# Altium schematic sheet SHIELD_ENC28J60.SchDoc
size A3
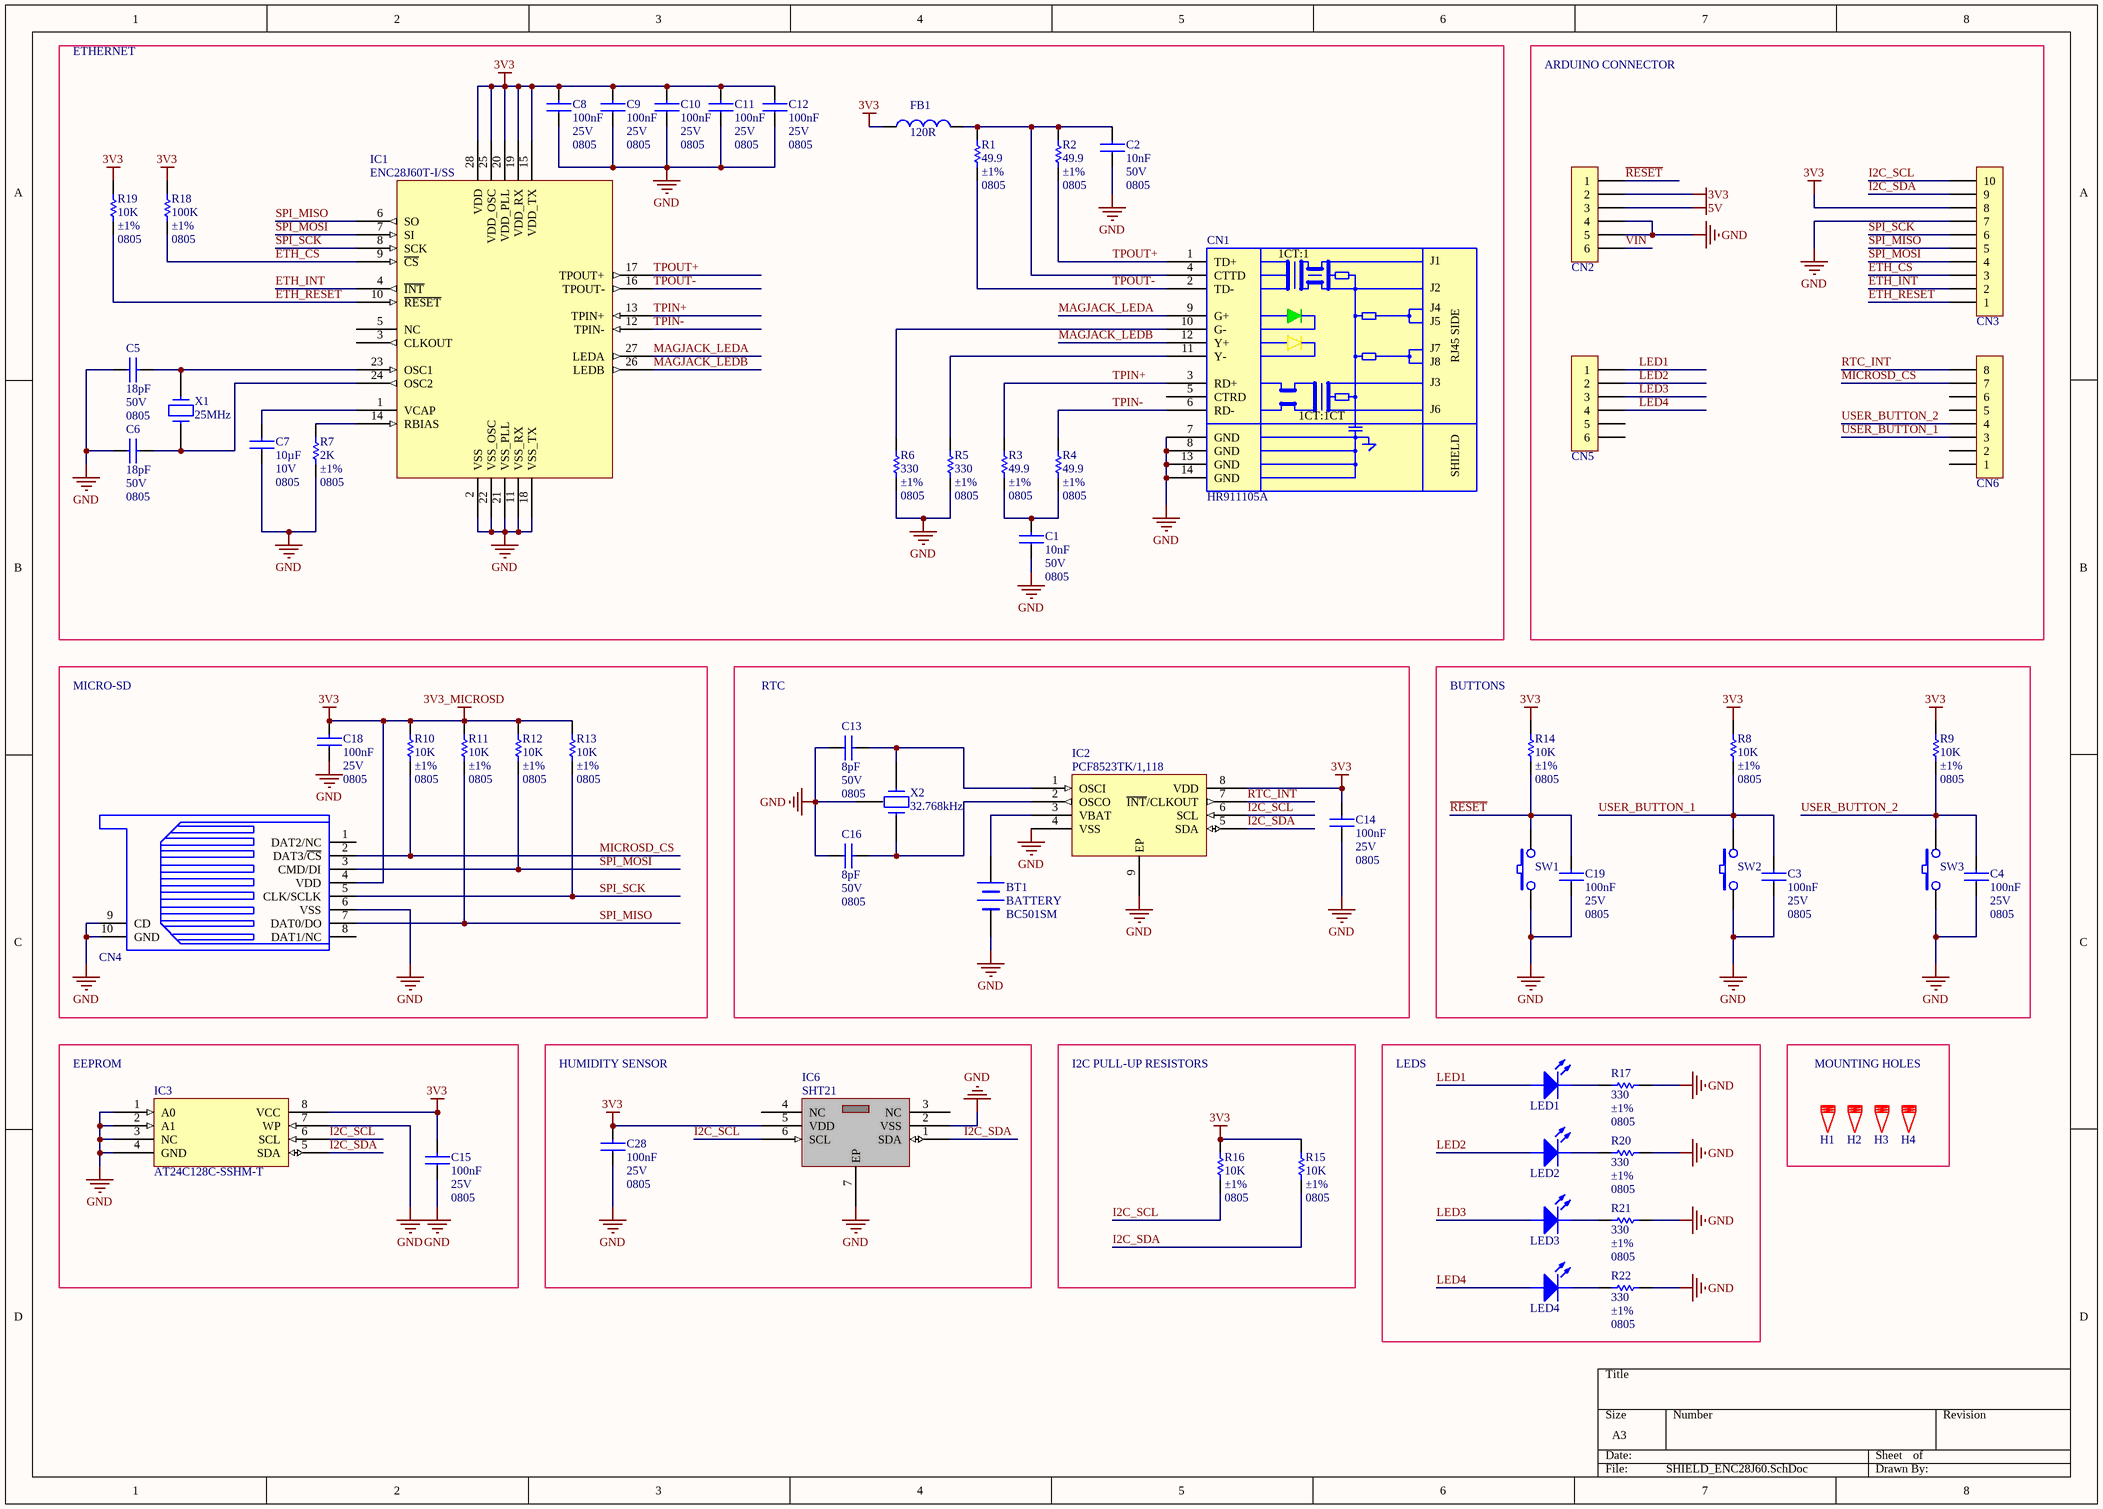
[diagram p0: SHIELD_ENC28J60.SchDoc]

## Parts
BT1  BATTERY  Manufacturer Part Number: BC501SM  [MPD_BC501SM]
C1  Capacitance: 10nF  Voltage - Rated: 50V  Package / Case: 0805  [CAPC2012X100N_EIA0805]  (hidden comment: CAP_NP)
C2  Capacitance: 10nF  Voltage - Rated: 50V  Package / Case: 0805  [CAPC2012X100N_EIA0805]  (hidden comment: CAP_NP)
C3  Capacitance: 100nF  Voltage - Rated: 25V  Package / Case: 0805  [CAPC2012X100N_EIA0805]  (hidden comment: CAP_NP)
C4  Capacitance: 100nF  Voltage - Rated: 25V  Package / Case: 0805  [CAPC2012X100N_EIA0805]  (hidden comment: CAP_NP)
C5  Capacitance: 18pF  Voltage - Rated: 50V  Package / Case: 0805  [CAPC2012X100N_EIA0805]  (hidden comment: CAP_NP)
C6  Capacitance: 18pF  Voltage - Rated: 50V  Package / Case: 0805  [CAPC2012X100N_EIA0805]  (hidden comment: CAP_NP)
C7  Capacitance: 10µF  Voltage - Rated: 10V  Package / Case: 0805  [CAPC2012X100N_EIA0805]  (hidden comment: CAP_NP)
C8  Capacitance: 100nF  Voltage - Rated: 25V  Package / Case: 0805  [CAPC2012X100N_EIA0805]  (hidden comment: CAP_NP)
C9  Capacitance: 100nF  Voltage - Rated: 25V  Package / Case: 0805  [CAPC2012X100N_EIA0805]  (hidden comment: CAP_NP)
C10  Capacitance: 100nF  Voltage - Rated: 25V  Package / Case: 0805  [CAPC2012X100N_EIA0805]  (hidden comment: CAP_NP)
C11  Capacitance: 100nF  Voltage - Rated: 25V  Package / Case: 0805  [CAPC2012X100N_EIA0805]  (hidden comment: CAP_NP)
C12  Capacitance: 100nF  Voltage - Rated: 25V  Package / Case: 0805  [CAPC2012X100N_EIA0805]  (hidden comment: CAP_NP)
C13  Capacitance: 8pF  Voltage - Rated: 50V  Package / Case: 0805  [CAPC2012X100N_EIA0805]  (hidden comment: CAP_NP)
C14  Capacitance: 100nF  Voltage - Rated: 25V  Package / Case: 0805  [CAPC2012X100N_EIA0805]  (hidden comment: CAP_NP)
C15  Capacitance: 100nF  Voltage - Rated: 25V  Package / Case: 0805  [CAPC2012X100N_EIA0805]  (hidden comment: CAP_NP)
C16  Capacitance: 8pF  Voltage - Rated: 50V  Package / Case: 0805  [CAPC2012X100N_EIA0805]  (hidden comment: CAP_NP)
C18  Capacitance: 100nF  Voltage - Rated: 25V  Package / Case: 0805  [CAPC2012X100N_EIA0805]  (hidden comment: CAP_NP)
C19  Capacitance: 100nF  Voltage - Rated: 25V  Package / Case: 0805  [CAPC2012X100N_EIA0805]  (hidden comment: CAP_NP)
C28  Capacitance: 100nF  Voltage - Rated: 25V  Package / Case: 0805  [CAPC2012X100N_EIA0805]  (hidden comment: CAP_NP)
CN1  HR911105A  [[HANRUN]HR911105A]
CN2  HDR_1X6  [HDRFV6W70P254_1X6_1524X254X1118P]  (value not drawn)
CN3  HDR_1X10  [HDRFV10W70P254_1X10_2540X254X1118P]  (value not drawn)
CN4  MICRO-SD  [MICRO-SD-SELF-EJECT]  (value not drawn)
CN5  HDR_1X6  [HDRFV6W70P254_1X6_1524X254X1118P]  (value not drawn)
CN6  HDR_1X8  [HDRFV8W70P254_1X8_2032X254X1118P]  (value not drawn)
FB1  Impedance: 120R  [FILC2012X100N_EIA0805]  (hidden comment: BEAD)
H1  HOLES  [HOLE_125MIL]  (value not drawn)
H2  HOLES  [HOLE_125MIL]  (value not drawn)
H3  HOLES  [HOLE_125MIL]  (value not drawn)
H4  HOLES  [HOLE_125MIL]  (value not drawn)
IC1  ENC28J60T-I/SS  [SOP65P780X200-28N_[MICROCHIP]SSOP28]
IC2  PCF8523TK/1,118  [SON80P400X100_HS-9N_[NXP]SOT909-1]
IC3  Manufacturer Part Number: AT24C128C-SSHM-T  [SOIC127P600X175-8N]  (hidden comment: AT24C128)
IC6  SHT21  [SHT21]
LED1  LED  [LEDC2012X70N_EIA0805_RED]  (value not drawn)
LED2  LED  [LEDC2012X70N_EIA0805_RED]  (value not drawn)
LED3  LED  [LEDC2012X70N_EIA0805_RED]  (value not drawn)
LED4  LED  [LEDC2012X70N_EIA0805_RED]  (value not drawn)
R1  Resistance (Ohm): 49.9  Tolerance: ±1%  Package / Case: 0805  [RESC2013X65N_EIA0805]  (hidden comment: RES)
R2  Resistance (Ohm): 49.9  Tolerance: ±1%  Package / Case: 0805  [RESC2013X65N_EIA0805]  (hidden comment: RES)
R3  Resistance (Ohm): 49.9  Tolerance: ±1%  Package / Case: 0805  [RESC2013X65N_EIA0805]  (hidden comment: RES)
R4  Resistance (Ohm): 49.9  Tolerance: ±1%  Package / Case: 0805  [RESC2013X65N_EIA0805]  (hidden comment: RES)
R5  Resistance (Ohm): 330  Tolerance: ±1%  Package / Case: 0805  [RESC2013X65N_EIA0805]  (hidden comment: RES)
R6  Resistance (Ohm): 330  Tolerance: ±1%  Package / Case: 0805  [RESC2013X65N_EIA0805]  (hidden comment: RES)
R7  Resistance (Ohm): 2K  Tolerance: ±1%  Package / Case: 0805  [RESC2013X65N_EIA0805]  (hidden comment: RES)
R8  Resistance (Ohm): 10K  Tolerance: ±1%  Package / Case: 0805  [RESC2013X65N_EIA0805]  (hidden comment: RES)
R9  Resistance (Ohm): 10K  Tolerance: ±1%  Package / Case: 0805  [RESC2013X65N_EIA0805]  (hidden comment: RES)
R10  Resistance (Ohm): 10K  Tolerance: ±1%  Package / Case: 0805  [RESC2013X65N_EIA0805]  (hidden comment: RES)
R11  Resistance (Ohm): 10K  Tolerance: ±1%  Package / Case: 0805  [RESC2013X65N_EIA0805]  (hidden comment: RES)
R12  Resistance (Ohm): 10K  Tolerance: ±1%  Package / Case: 0805  [RESC2013X65N_EIA0805]  (hidden comment: RES)
R13  Resistance (Ohm): 10K  Tolerance: ±1%  Package / Case: 0805  [RESC2013X65N_EIA0805]  (hidden comment: RES)
R14  Resistance (Ohm): 10K  Tolerance: ±1%  Package / Case: 0805  [RESC2013X65N_EIA0805]  (hidden comment: RES)
R15  Resistance (Ohm): 10K  Tolerance: ±1%  Package / Case: 0805  [RESC2013X65N_EIA0805]  (hidden comment: RES)
R16  Resistance (Ohm): 10K  Tolerance: ±1%  Package / Case: 0805  [RESC2013X65N_EIA0805]  (hidden comment: RES)
R17  Resistance (Ohm): 330  Tolerance: ±1%  Package / Case: 0805  [RESC2013X65N_EIA0805]  (hidden comment: RES)
R18  Resistance (Ohm): 100K  Tolerance: ±1%  Package / Case: 0805  [RESC2013X65N_EIA0805]  (hidden comment: RES)
R19  Resistance (Ohm): 10K  Tolerance: ±1%  Package / Case: 0805  [RESC2013X65N_EIA0805]  (hidden comment: RES)
R20  Resistance (Ohm): 330  Tolerance: ±1%  Package / Case: 0805  [RESC2013X65N_EIA0805]  (hidden comment: RES)
R21  Resistance (Ohm): 330  Tolerance: ±1%  Package / Case: 0805  [RESC2013X65N_EIA0805]  (hidden comment: RES)
R22  Resistance (Ohm): 330  Tolerance: ±1%  Package / Case: 0805  [RESC2013X65N_EIA0805]  (hidden comment: RES)
SW1  SWITCH_TACTILE_2PIN  [C&K_RS-282G05A3-SM_RT]  (value not drawn)
SW2  SWITCH_TACTILE_2PIN  [C&K_RS-282G05A3-SM_RT]  (value not drawn)
SW3  SWITCH_TACTILE_2PIN  [C&K_RS-282G05A3-SM_RT]  (value not drawn)
X1  value 25MHz  [HC-49/US]  (hidden comment: CRYSTAL)
X2  value 32.768kHz  [32.768_DIP]  (hidden comment: CRYSTAL_32K)

## Blocks framed on the sheet
ETHERNET: C1 C2 C5-C12 CN1 FB1 IC1 R1-R7 R18 R19 X1
ARDUINO CONNECTOR: CN2 CN3 CN5 CN6
MICRO-SD: C18 CN4 R10-R13
RTC: BT1 C13 C14 C16 IC2 X2
BUTTONS: C3 C4 C19 R8 R9 R14 SW1-SW3
EEPROM: C15 IC3
HUMIDITY SENSOR: C28 IC6
I2C PULL-UP RESISTORS: R15 R16
LEDS: LED1-LED4 R17 R20-R22
MOUNTING HOLES: H1-H4

## Nets
3V3: C8.2 C9.2 C10.2 C11.2 C12.2 C14.2 C15.2 C18.2 C28.2 CN2.2 CN3.8 CN4.4(VDD) FB1.1 IC1.15(VDD_TX) IC1.19(VDD_RX) IC1.20(VDD_PLL) IC1.25(VDD_OSC) IC1.28(VDD) IC2.8(VDD) IC3.8(VCC) IC6.5(VDD) R8.1 R9.1 R10.1 R11.1 R12.1 R13.1 R14.1 R15.1 R16.1 R18.1 R19.1  [also labelled 3V3_MICROSD]
5V: CN2.3
GND: BT1.2(-) C1.1 C2.1 C3.1 C4.1 C5.1 C6.1 C7.1 C8.1 C9.1 C10.1 C11.1 C12.1 C13.1 C14.1 C15.1 C16.1 C18.1 C19.1 C28.1 CN1.7(GND) CN1.8(GND) CN1.13(GND) CN1.14(GND) CN2.4 CN2.5 CN3.7 CN4.6(VSS) CN4.9(CD) CN4.10(GND) IC1.2(VSS) IC1.11(VSS_RX) IC1.18(VSS_TX) IC1.21(VSS_PLL) IC1.22(VSS_OSC) IC2.4(VSS) IC2.9(EP) IC3.1(A0) IC3.2(A1) IC3.3(NC) IC3.4(GND) IC3.7(WP) IC6.2(VSS) IC6.7(EP) R5.2 R6.2 R7.2 R17.2 R20.1 R21.1 R22.1 SW1.1 SW2.1 SW3.1 X2.3
ETH_CS: CN3.3 IC1.9(~{CS}) R18.2
ETH_INT: CN3.2 IC1.4(~{INT})
ETH_RESET: CN3.1 IC1.10(~{RESET}) R19.2
I2C_SCL: CN3.10 IC2.6(SCL) IC3.6(SCL) IC6.6(SCL) R16.2
I2C_SDA: CN3.9 IC2.5(SDA) IC3.5(SDA) IC6.1(SDA) R15.2
LED1: CN5.1 LED1.2
LED2: CN5.2 LED2.2
LED3: CN5.3 LED3.2
LED4: CN5.4 LED4.2
MAGJACK_LEDA: CN1.9(G+) IC1.27(LEDA)
MAGJACK_LEDB: CN1.12(Y+) IC1.26(LEDB)
MICROSD_CS: CN4.2(DAT3/~{CS}) CN6.7 R10.2
~{RESET}: C19.2 CN2.1 R14.2 SW1.2
RTC_INT: CN6.8 IC2.7(~{INT}/CLKOUT)
SPI_MISO: CN3.5 CN4.7(DAT0/DO) IC1.6(SO) R11.2
SPI_MOSI: CN3.4 CN4.3(CMD/DI) IC1.7(SI) R12.2
SPI_SCK: CN3.6 CN4.5(CLK/SCLK) IC1.8(SCK) R13.2
TPIN+: CN1.3(RD+) IC1.13(TPIN+) R3.1
TPIN-: CN1.6(RD-) IC1.12(TPIN-) R4.1
TPOUT+: CN1.1(TD+) IC1.17(TPOUT+) R2.2
TPOUT-: CN1.2(TD-) IC1.16(TPOUT-) R1.2
USER_BUTTON_1: C3.2 CN6.3 R8.2 SW2.2
USER_BUTTON_2: C4.2 CN6.4 R9.2 SW3.2
VIN: CN2.6
NetBT1_1: BT1.1(+) IC2.3(VBAT)
NetC1_2: C1.2 R3.2 R4.2
NetC2_2: C2.2 CN1.4(CTTD) FB1.2 R1.1 R2.1
NetC5_2: C5.2 IC1.23(OSC1) X1.2
NetC6_2: C6.2 IC1.24(OSC2) X1.1
NetC7_2: C7.2 IC1.1(VCAP)
NetC13_2: C13.2 IC2.1(OSCI) X2.1
NetC16_2: C16.2 IC2.2(OSCO) X2.2
NetCN1_10: CN1.10(G-) R6.1
NetCN1_11: CN1.11(Y-) R5.1
NetIC1_14: IC1.14(RBIAS) R7.1
NetLED1_1: LED1.1 R17.1
NetLED2_1: LED2.1 R20.2
NetLED3_1: LED3.1 R21.2
NetLED4_1: LED4.1 R22.2

Not connected (* = marked no-connect by the designer): CN1 5(CTRD); CN4 1(DAT2/NC) 8(DAT1/NC); CN5 5 6; CN6 1 2 5 6; IC1 3(CLKOUT) 5(NC); IC6 3(NC) 4(NC)

## Notes on the sheet
- (in symbol SCON00127) 1CT:1; J1; J2; J4; J5; J7; RJ45 SIDE; J8; J3; J6; 1CT:1CT; SHIELD

## Library data of the parts
BT1 = SBAT00011: HOLDER COIN CELL FOR CR1220 SMD; Manufacturer: MPD (Memory Protection Devices); Value: BC501SM; Voltage: 3V; Battery Chemistry: Coin Cell, Holder; Battery Cell Size: Coin, 12.0mm; Cost x10 ($): 0.81000; Cost x100 ($): 0.73000; Cost x1000 ($): 0.59000; Distrubutor: Digikey; Lead Time: 12 Weeks; Cost x1 ($): 0.88000; Part Number: SBAT00011; Mounting Type: PCB, Surface Mount; Category: Battery Products; Family: Battery Holders, Clips, Contacts; Distributor Part Number: BC501SM-ND; ROHS: YES; Distributor Link: http://www.digikey.com/product-detail/en/mpd-memory-protection-devices/BC501SM/BC501SM-ND/2439260; Moisture Sensitivity Level (MSL): 1 (Unlimited); Quantity: 20
C1 C2 = SCAP00300085: CAP CER 10000PF 50V X7R 0805; Manufacturer: Samsung Electro-Mechanics America, Inc.; Manufacturer Part Number: CL21B103KBANNNC; Value: 10nF; Tolerance: ±10%; Type: Multi Layer Ceramic Capacitor  (MLCC); Cost x1 ($): 0.10000; Cost x10 ($): 0.02700; Cost x100 ($): 0.01210; Cost x1000 ($): 0.00677; Distrubutor: Digikey; Lead Time: 11 Weeks; Part Number: SCAP00300085; Temperature Coefficient: X7R; Operating Temperature: -55°C ~ 125°C; Mounting Type: Surface Mount, MLCC; Size / Dimension: 0.079" L x 0.049" W (2.00mm x 1.25mm); Category: Capacitors; Family: Ceramic Capacitors; Distributor Part Number: 1276-1015-1-ND; Distributor Link: http://www.digikey.com/product-detail/en/samsung-electro-mechanics-america-inc/CL21B103KBANNNC/1276-1015-1-ND/3889101; ROHS: YES; Moisture Sensitivity Level (MSL): 1 (Unlimited); Quantity: 50
C3 C4 C8-C12 C14 C15 C18 C19 C28 = SCAP00300093: CAP CER 0.1UF 25V X7R 0805; Manufacturer: Samsung Electro-Mechanics America, Inc.; Manufacturer Part Number: CL21B104KACNNNC; Value: 100nF; Tolerance: ±10%; Type: Multi Layer Ceramic Capacitor  (MLCC); Cost x1 ($): 0.10000; Cost x10 ($): 0.03300; Cost x100 ($): 0.01470; Cost x1000 ($): 0.00825; Distrubutor: Digikey; Lead Time: 11 Weeks; Part Number: SCAP00300093; Temperature Coefficient: X7R; Operating Temperature: -55°C ~ 125°C; Mounting Type: Surface Mount, MLCC; Size / Dimension: 0.079" L x 0.049" W (2.00mm x 1.25mm); Category: Capacitors; Family: Ceramic Capacitors; Distributor Part Number: 1276-1099-1-ND; Distributor Link: http://www.digikey.com/product-detail/en/samsung-electro-mechanics-america-inc/CL21B104KACNNNC/1276-1099-1-ND/3889185; ROHS: YES; Moisture Sensitivity Level (MSL): 1 (Unlimited); Quantity: 50
C5 C6 = SCAP00300040: CAP CER 18PF 50V NP0 0805; Manufacturer: Samsung Electro-Mechanics America, Inc.; Manufacturer Part Number: CL21C180JBANNNC; Tolerance: ±5%; Temperature Coefficient: C0G, NP0; Type: Multi Layer Ceramic Capacitor  (MLCC); Cost x1 ($): 0.10000; Cost x10 ($): 0.04400; Cost x100 ($): 0.01960; Cost x1000 ($): 0.01100; Distrubutor: Digikey; Lead Time: 11 Weeks; Part Number: SCAP00300040; Value: 18pF; Operating Temperature: -55°C ~ 125°C; Mounting Type: Surface Mount, MLCC; Size / Dimension: 0.079" L x 0.049" W (2.00mm x 1.25mm); Category: Capacitors; Family: Ceramic Capacitors; Distributor Part Number: 1276-1107-1-ND; Distributor Link: http://www.digikey.com/product-detail/en/samsung-electro-mechanics-america-inc/CL21C180JBANNNC/1276-1107-1-ND/3889193; ROHS: YES; Moisture Sensitivity Level (MSL): 1 (Unlimited); Quantity: 50
C7 = SCAP00300106: CAP CER 10UF 10V X5R 0805; Manufacturer: Samsung Electro-Mechanics America, Inc; Manufacturer Part Number: CL21A106KPFNNNE; Tolerance: ±10%; Type: Multi Layer Ceramic Capacitor  (MLCC); Cost x1 ($): 0.18000; Cost x10 ($): 0.13000; Cost x100 ($): 0.06090; Cost x1000 ($): 0.03535; Distrubutor: Digikey; Lead Time: 11 Weeks; Part Number: SCAP00300106; Value: 10uF; Temperature Coefficient: X5R; Operating Temperature: -55°C ~ 85°C; Mounting Type: Surface Mount, MLCC; Size / Dimension: 0.079" L x 0.049" W (2.00mm x 1.25mm); Category: Capacitors; Family: Ceramic Capacitors; Distributor Part Number: 1276-1052-1-ND; Distributor Link: http://www.digikey.com/product-detail/en/samsung-electro-mechanics-america-inc/CL21A106KPFNNNE/1276-1052-1-ND/3889138; ROHS: YES; Moisture Sensitivity Level (MSL): 1 (Unlimited); Quantity: 50
C13 C16 = SCAP00300030: CAP CER 8PF 50V NP0 0805; Manufacturer: Samsung Electro-Mechanics America, Inc.; Manufacturer Part Number: CL21C080CBANNNC; Tolerance: ±0.25pF; Temperature Coefficient: C0G, NP0; Type: Multi Layer Ceramic Capacitor  (MLCC); Cost x1 ($): 0.10000; Cost x10 ($): 0.01900; Cost x100 ($): 0.00860; Cost x1000 ($): 0.00481; Distrubutor: Digikey; Lead Time: 11 Weeks; Part Number: SCAP00300030; Value: 8pF; Operating Temperature: -55°C ~ 125°C; Mounting Type: Surface Mount, MLCC; Size / Dimension: 0.079" L x 0.049" W (2.00mm x 1.25mm); Category: Capacitors; Family: Ceramic Capacitors; Distributor Part Number: 1276-2556-1-ND; Distributor Link: http://www.digikey.com/product-detail/en/samsung-electro-mechanics-america-inc/CL21C080CBANNNC/1276-2556-1-ND/3890642; ROHS: YES; Moisture Sensitivity Level (MSL): 1 (Unlimited); Quantity: 50
CN1 = SCON00127: CONN MAGJACK 1PORT 100 BASE-T; Connector Type: RJ45; Distrubutor: Digikey; Part Number: SCON00127; Value: HR911105A; Category: Connectors, Interconnects; Family: Modular Connectors - Jacks With Magnetics; Mounting Type: Through Hole; Quantity: 10
CN2 CN5 = SCON00124: CONN ARDUINO HEADER .0100" 6POS; Pitch: 2.54mm; Distrubutor: Digikey; Part Number: SCON00124; Value: HDR_1X6; Category: Connectors, Interconnects; Family: Rectangular Connectors - Headers, Receptacles, Female Sockets; Connector Type: Header; Contact Type: Female Socket; Mounting Type: Through Hole
CN3 = SCON00126: CONN ARDUINO HEADER .0100" 10POS; Pitch: 2.54mm; Distrubutor: Digikey; Part Number: SCON00126; Value: HDR_1X10; Category: Connectors, Interconnects; Family: Rectangular Connectors - Headers, Receptacles, Female Sockets; Connector Type: Header; Contact Type: Female Socket; Mounting Type: Through Hole
CN4 = SCON00094: CONN MICRO SD CARD PUSH-PUSH R/A; Manufacturer: TransFlash; Connector Type: Connector and Ejector; Cost (x1): $0.284; Part Number: SCON00094; Value: MICRO-SD; Category: Connectors, Interconnects; Family: Memory Connectors - PC Cards - Secure Digital - microSD™; Mounting Type: SMD; ROHS: YES; Quantity: 10
CN6 = SCON00125: CONN ARDUINO HEADER .0100" 8POS; Pitch: 2.54mm; Distrubutor: Digikey; Part Number: SCON00125; Value: HDR_1X8; Category: Connectors, Interconnects; Family: Rectangular Connectors - Headers, Receptacles, Female Sockets; Connector Type: Header; Contact Type: Female Socket; Mounting Type: Through Hole
FB1 = SFIL00005: FERRITE CHIP POWER 120 OHM SMD; Manufacturer: Laird-Signal Integrity Products; Manufacturer Part Number: HI0805O121R-10; Type: Differential Mode - Single; Current Rating: 3.5A; DC Resistance (DCR): 20 mOhm Max; Cost x10 ($): 0.08700; Cost x100 ($): 0.05230; Cost x1000 ($): 0.03010; Distrubutor: Digikey; Cost x1 ($): 0.10000; Part Number: SFIL00005; Package / Case: 0805 (2012 Metric); Value: BEAD; Category: Filters; Family: Ferrite Beads and Chips; Distributor Part Number: 240-2393-1-ND; ROHS: YES; Datasheet Link: http://www.digikey.com/product-detail/en/HI0805O121R-10/240-2393-1-ND/806753; Quantity: 50
H1-H4 = SMSC00005: Value: HOLE_125MIL; Part Number: SMSC00005
IC1 = SIC00131: IC ETHERNET CTLR SPI 28SSOP; Manufacturer: Microchip Technology; Vin: 3.1 V ~ 3.6 V; Iin: 160mA; Cost x10 ($): 2.84000; Cost x100 ($): 2.36000; Distrubutor: Digikey; Part Number: SIC00131; Value: ENC28J60; Protocol: SPI; Operating Temperature: -40°C ~ 85°C; Category: Integrated Circuits (ICs); Family: Interface - Controllers; Package / Case: 28-SSOP (0.209", 5.30mm Width); Type: Ethernet Controller; Manufacturer Part Number: ENC28J60T-I/SS; Distributor Part Number: ENC28J60T-I/SSCT-ND; ROHS: YES; Distributor Link: http://www.digikey.com/product-detail/en/microchip-technology/ENC28J60T-I-SS/ENC28J60T-I-SSCT-ND/2332862; Quantity: 0; Cost x1 ($): 2.84000
IC2 = SIC00133: IC RTC CLK/CALENDAR I2C 8-HVSON; Manufacturer: NXP Semiconductors; Vin: 1.6 V ~ 5.5 V; Protocol: I²C, 2-Wire Serial; Iin: 0.5µA @ 2V ~ 5V; Cost x10 ($): 1.19200; Cost x100 ($): 0.92900; Cost x1000 ($): 0.60760; Distrubutor: Digikey; Lead Time: 7 Weeks; Cost x1 ($): 1.33000; Part Number: SIC00133; Manufacturer Part Number: PCF8523TK/1,118; Value: PCF8523; Operating Temperature: -40°C ~ 85°C; Category: Integrated Circuits (ICs); Family: Clock/Timing - Real Time Clocks; Package / Case: 8-VDFN Exposed Pad, 8-HVSON (4x4); Type: Clock/Calendar; Distributor Part Number: 568-6648-1-ND; ROHS: YES; Distributor Link: http://www.digikey.com/product-detail/en/nxp-semiconductors/PCF8523TK-1,118/568-6648-1-ND/2617087; MSL: 1 (Unlimited); Quantity: 5
IC3 = SMEM00014: IC EEPROM 128KBIT 1MHZ 8SOIC; Manufacturer: Atmel; Voltage: 1.7 V ~ 5.5 V; Memory Size: 128K (16K x 8); Speed: 400kHz, 1MHz; Interface: I²C, 2-Wire Serial; Format - Memory: EEPROMs - Serial; Cost (x10): 0.58600; Cost (x100): 0.51410; Cost (x1000): 0.48411; Distrubutor: Digikey; Lead Time: 5 Weeks; Cost $ (x1): 0.64000; Part Number: SMEM00014; Value: AT24C128; Package: SMD; Category: Integrated Circuits (ICs); Family: Memory; Memory Type: EEPROM; Package / Case: 8-SOIC (0.154", 3.90mm Width); Distributor Part Number: AT24C128C-SSHM-TCT-ND; Distributor Link: http://www.digikey.com/product-detail/en/atmel/AT24C128C-SSHM-T/AT24C128C-SSHM-TCT-ND/3178459; ROHS: YES; Quantity: 10
IC6 = SSEN00014: HUMIDITY AND TEMPERATURE SENSOR; Manufacturer: Sensirion AG; Voltage: 2.1 V ~ 3.6 V; Output Type: I²C; Sensor Type: Humidity, Temperature; Cost x10($): 7.07900; Cost x100 ($): 5.03360; Distrubutor: DigiKey; Lead Time: 4 Weeks; Cost x1 ($): 8.97000; Part Number: SSEN00014; Value: SHT21; Operating Temperature: -40°C ~ 125°C; Category: Sensors, Transducers; Family: Moisture Sensors, Humidity; Cost x1000 ($): 5.03360; Manufacturer Part Number: SHT21; Distributor Part Number: 1649-1005-1-ND; ROHS: YES; Distributor Link: http://www.digikey.com/product-detail/en/sensirion-ag/SHT21/1649-1005-1-ND/5872287; MSL: 1 (Unlimited); Quantity: 0
LED1-LED4 = SOPT00004: LED SUPER RED CLR THIN 0805 SMD; Manufacturer: Lite-On Inc; Manufacturer Part Number: LTST-C171KRKT; Value: LED_RED; Cost x10 ($): 0.24800; Cost x100 ($): 0.13500; Cost x1000 ($): 0.05850; Distrubutor: Digikey; Cost x1 ($): 0.32000; Part Number: SOPT00004; Package / Case: 0805 (2012 Metric); Category: Optoelectronics; Family: LED Indication - Discrete; Type: LED; Distributor Part Number: 160-1427-1-ND; ROHS: YES; Datasheet Link: http://www.digikey.com/product-detail/en/LTST-C171KRKT/160-1427-1-ND/386800; Quantity: 110
R1-R4 = SRES03030081: RES SMD 49.9 OHM 1% 1/8W 0805; Manufacturer: Samsung Electro-Mechanics America, Inc.; Manufacturer Part Number: RC2012F49R9CS; Value: 49R9; Power (Watts): 0.125W, 1/8W; Cost x1 ($): 0.10000; Cost x10 ($): 0.02200; Cost x100 ($): 0.00910; Cost x1000 ($): 0.00408; Distrubutor: Digikey; Part Number: SRES03030081; Category: Resistors; Family: Chip Resistor - Surface Mount; Distributor Part Number: 1276-5210-1-ND; Distributor Link: http://www.digikey.com/product-detail/en/samsung-electro-mechanics-america-inc/RC2012F49R9CS/1276-5210-1-ND/3968182; ROHS: YES; Quantity: 0
R5 R6 R17 R20-R22 = SRES03010062: RES SMD 330 OHM 1% 1/8W 0805; Manufacturer: Yageo; Manufacturer Part Number: RC0805FR-07330RL; Value: 330R; Power (Watts): 0.125W, 1/8W; Cost x1 ($): 0.10; Cost x10 ($): 0.21; Cost x100 ($): 0.84; Cost x1000 ($): 3.79; Distrubutor: Digikey; Part Number: SRES03010062; Category: Resistors; Family: Chip Resistor - Surface Mount; Distributor Part Number: 311-330CRCT-ND; Distributor Link: http://www.digikey.com/product-detail/en/RC0805FR-07330RL/311-330CRCT-ND/730813; ROHS: YES; Quantity: 0
R7 = SRES03010081: RES SMD 2K OHM 1% 1/8W 0805; Manufacturer: Yageo; Manufacturer Part Number: RC0805FR-072KL; Power (Watts): 0.125W, 1/8W; Cost x1 ($): 0.10; Cost x10 ($): 0.21; Cost x100 ($): 0.84; Cost x1000 ($): 3.79; Distrubutor: Digikey; Part Number: SRES03010081; Value: 2K; Category: Resistors; Family: Chip Resistor - Surface Mount; Distributor Part Number: 311-2.00KCRCT-ND; Distributor Link: http://www.digikey.com/product-detail/en/RC0805FR-072KL/311-2.00KCRCT-ND/730611; ROHS: YES; Quantity: 0
R8-R16 R19 = SRES03010098: RES SMD 10K OHM 1% 1/8W 0805; Manufacturer: Yageo; Manufacturer Part Number: RC0805FR-0710KL; Power (Watts): 0.125W, 1/8W; Cost x1 ($): 0.10; Cost x10 ($): 0.21; Cost x100 ($): 0.84; Cost x1000 ($): 3.79; Distrubutor: Digikey; Part Number: SRES03010098; Value: 10K; Category: Resistors; Family: Chip Resistor - Surface Mount; Distributor Part Number: 311-10.0KCRCT-ND; Distributor Link: http://www.digikey.com/product-detail/en/RC0805FR-0710KL/311-10.0KCRCT-ND/730482; ROHS: YES; Quantity: 0
R18 = SRES03010122: RES SMD 100K OHM 1% 1/8W 0805; Manufacturer: Yageo; Manufacturer Part Number: RC0805FR-07100KL; Power (Watts): 0.125W, 1/8W; Cost x1 ($): 0.10; Cost x10 ($): 0.21; Cost x100 ($): 0.84; Cost x1000 ($): 3.79; Distrubutor: Digikey; Part Number: SRES03010122; Value: 100K; Category: Resistors; Family: Chip Resistor - Surface Mount; Distributor Part Number: 311-100KCRCT-ND; Distributor Link: http://www.digikey.com/product-detail/en/RC0805FR-07100KL/311-100KCRCT-ND/730491; ROHS: YES; Quantity: 0
SW1-SW3 = SSWI00022: SWITCH TACTILE SPST-NO 0.05A 12V; Manufacturer: C&K Components; Manufacturer Part Number: RS-282G05A3-SM RT; Value: SWITCH_TACTILE_MICRO_2PIN; Voltage: 12VDC; Cost x10 ($): 0.72900; Cost x100 ($): 0.55000; Cost x1000 ($): 0.39875; Distrubutor: Digikey; Lead Time: 10 Weeks; Cost x1 ($): 0.76000; Part Number: SSWI00022; Current: 0.05A; Package: SMD; Category: Switches; Family: Tactile Switches; Circuit: SPST-NO; Distributor Part Number: CKN10384CT-ND; Distrubutor Link: http://www.digikey.com/product-detail/en/c-k-components/RS-282G05A3-SM-RT/CKN10384CT-ND/2747203; ROHS: YES; Moisture Sensitivity Level (MSL): 1 (Unlimited); Datasheet Link: 0
X1 = SCRY00016: CRYSTAL 25.0000MHZ 18PF T/H; Manufacturer: CTS-Frequency Controls; Manufacturer Part Number: ATS250B-E; ESR: 30 Ohm; Cost (x10): 0.30000; Cost (x100): 0.24000; Cost (x1000): 0.19200; Distrubutor: Digikey; Lead Time: 6 Weeks; Cost (x1): 0.36000; Part Number: SCRY00016; Mounting Type: Through Hole; Load Capacitance: 18pF; Package / Case: HC49/US; Type: MHz Crystal; Distributor Part Number: CTX928-ND; ROHS: YES; Datasheet Link: http://www.digikey.com/product-detail/en/cts-frequency-controls/ATS250B-E/CTX928-ND/2292924
X2 = SCRY00009: CRYSTAL 32.768KHZ 6PF THRU; Manufacturer: Seiko Instruments; Manufacturer Part Number: VT200F-6PF20PPM; ESR: 50 kOhm; Cost (x10): 0.25000; Cost (x100): 0.20000; Cost (x1000): 0.16000; Distrubutor: Digikey; Cost (x1): 0.30000; Part Number: SCRY00009; Mounting Type: Through Hole; Load Capacitance: 6pF; Package / Case: Cylindrical Can, Radial; Type: kHz Crystal (Tuning Fork); Distributor Part Number: 728-1000-ND; Datasheet Link: http://www.digikey.com/product-detail/en/VT200F-6PF20PPM/728-1000-ND/1626715